# EAGLE design STM32F446RET-Breakout (EAGLE 7.6.0)
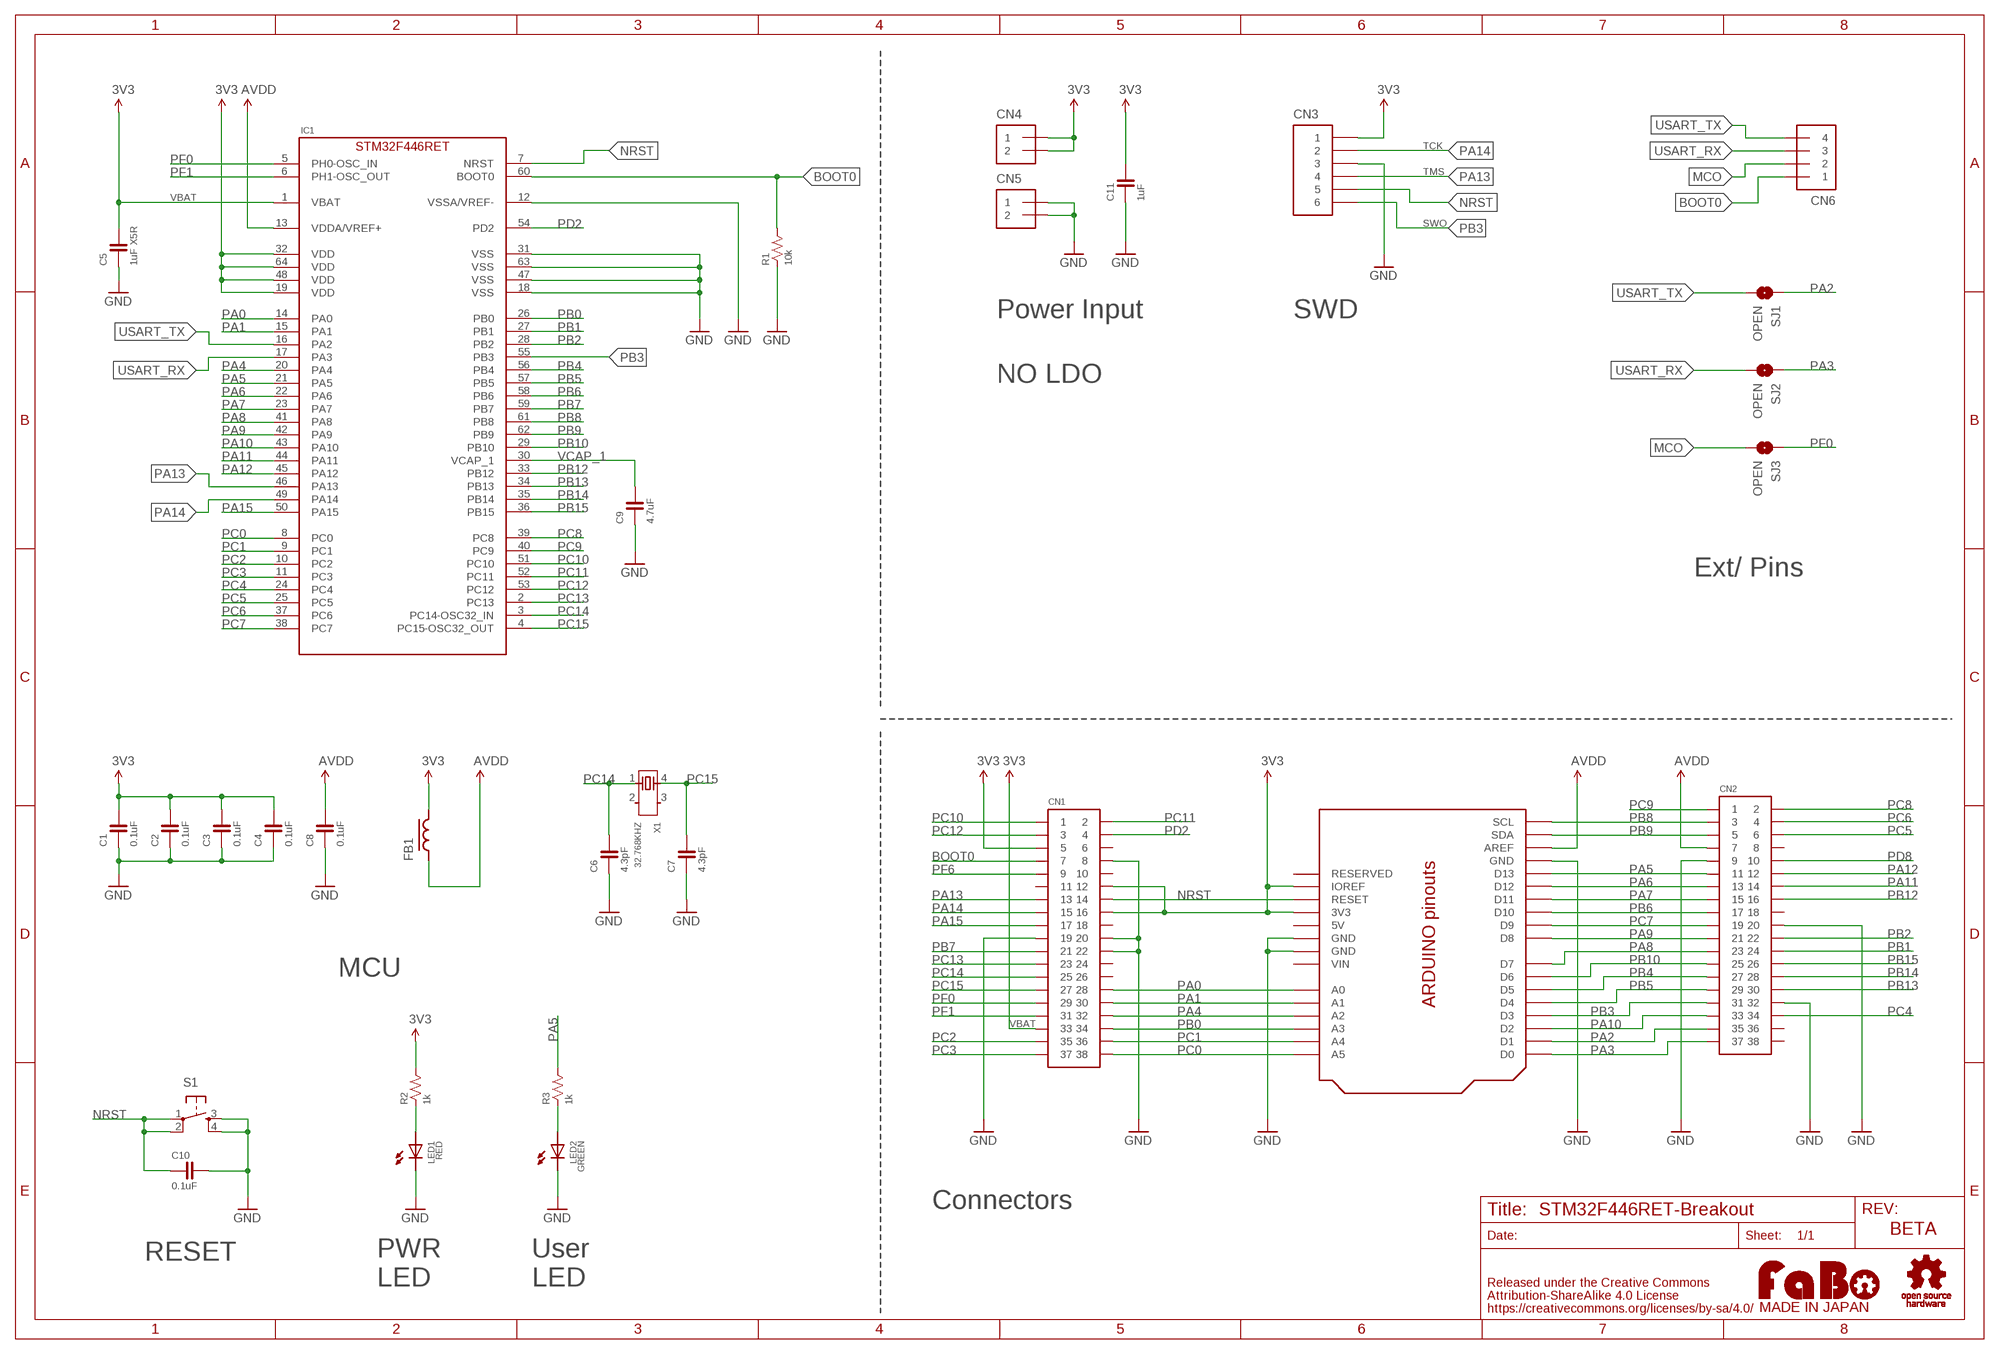
[diagram p0: schematic, sheet 1]

## Parts
C1  0.1uF  CAPACITOR-0603  [0603]
C2  0.1uF  CAPACITOR-0603  [0603]
C3  0.1uF  CAPACITOR-0603  [0603]
C4  0.1uF  CAPACITOR-0603  [0603]
C5  1uF X5R  CAPACITOR-0603  [0603]
C6  4.3pF  CAPACITOR-0603  [0603]
C7  4.3pF  CAPACITOR-0603  [0603]
C8  0.1uF  CAPACITOR-0603  [0603]
C9  4.7uF  CAPACITOR-0603  [0603]
C10  0.1uF  CAPACITOR-0603  [0603]
C11  1uF  CAPACITOR-0603  [0603]
CN1  PIN_HEADER_2X19  [PIN_2X19]
CN2  PIN_HEADER_2X19  [PIN_2X19]
CN3  PIN_HEADER_1X6  [PIN_1X6]
CN4  PIN_HEADER_1X2  [PIN_1X2_LONG]
CN5  PIN_HEADER_1X2  [PIN_1X2_LONG]
CN6  PIN_HEADER_1X4  [PIN_1X4_SNEAKY]
FB1  FERRITEBEADS  [EIA0603]
IC1  STM32F446RET  [LQFP-64]
LED1  RED  LED-0603  [0603]
LED2  GREEN  LED-0603  [0603]
R1  10k  RESISTOR-0603  [0603]
R2  1k  RESISTOR-0603  [0603]
R3  1k  RESISTOR-0603  [0603]
S1  TACT-SWITCH-6MM  [DTS_6_V]
SJ1  OPEN  SMD-JUMPER-2-OPEN  [SMD-JUMPER-2-OPEN]
SJ2  OPEN  SMD-JUMPER-2-OPEN  [SMD-JUMPER-2-OPEN]
SJ3  OPEN  SMD-JUMPER-2-OPEN  [SMD-JUMPER-2-OPEN]
U1  ARDUINO_UNO_R3_SHIELD-NUCLEO  [NUCLEO]
U$2  LOGO_FABO-M  [LOGO_FABO_MS]
U$3  LOGO_OSHW-M_BOTTOM  [LOGO_OSHW_M_BOTTOM]
X1  32.768KHZ  CRYSTAL-4PIN  [ABRACON-ABS25-32.768KHZ]

## Nets
3V3: C1.2 C2.2 C3.2 C4.2 C5.2 C11.2 CN1.5 CN1.12 CN1.16 CN1.33 CN3.1 CN4.1 CN4.2 FB1.2 IC1.1(VBAT) IC1.19(VDD) IC1.32(VDD) IC1.48(VDD) IC1.64(VDD) R2.2 U1.3V3 U1.IOREF
AVDD: C8.2 CN2.7 FB1.1 IC1.13(VDDA/VREF+) U1.AREF
BOOT0: CN1.7 CN6.1 IC1.60(BOOT0) R1.2
GND: C1.1 C2.1 C3.1 C4.1 C5.1 C6.1 C7.1 C8.1 C9.1 C10.2 C11.1 CN1.8 CN1.19 CN1.20 CN1.22 CN2.9 CN2.20 CN2.32 CN3.3 CN5.1 CN5.2 IC1.12(VSSA/VREF-) IC1.18(VSS) IC1.31(VSS) IC1.47(VSS) IC1.63(VSS) LED1.CATHODE LED2.CATHODE R1.1 S1.3 S1.4 U1.GND1(GND) U1.GND2(GND) U1.GND3(GND)
MCO: CN6.2 SJ3.2
NRST: C10.1 CN1.14 CN3.5 IC1.7(NRST) S1.1 S1.2 U1.RESET
PA0: CN1.28 IC1.14(PA0) U1.A0
PA1: CN1.30 IC1.15(PA1) U1.A1
PA2: CN2.35 SJ1.1 U1.D1
PA3: CN2.37 SJ2.1 U1.D0
PA4: CN1.32 IC1.20(PA4) U1.A2
PA5: CN2.11 IC1.21(PA5) R3.2 U1.D13
PA6: CN2.13 IC1.22(PA6) U1.D12
PA7: CN2.15 IC1.23(PA7) U1.D11
PA8: CN2.23 IC1.41(PA8) U1.D7
PA9: CN2.21 IC1.42(PA9) U1.D8
PA10: CN2.33 IC1.43(PA10) U1.D2
PA11: CN2.14 IC1.44(PA11)
PA12: CN2.12 IC1.45(PA12)
PA13: CN1.13 CN3.4 IC1.46(PA13)
PA14: CN1.15 CN3.2 IC1.49(PA14)
PA15: CN1.17 IC1.50(PA15)
PB0: CN1.34 IC1.26(PB0) U1.A3
PB1: CN2.24 IC1.27(PB1)
PB2: CN2.22 IC1.28(PB2)
PB3: CN2.31 CN3.6 IC1.55(PB3) U1.D3
PB4: CN2.27 IC1.56(PB4) U1.D5
PB5: CN2.29 IC1.57(PB5) U1.D4
PB6: CN2.17 IC1.58(PB6) U1.D10
PB7: CN1.21 IC1.59(PB7)
PB8: CN2.3 IC1.61(PB8) U1.SCL
PB9: CN2.5 IC1.62(PB9) U1.SDA
PB10: CN2.25 IC1.29(PB10) U1.D6
PB12: CN2.16 IC1.33(PB12)
PB13: CN2.30 IC1.34(PB13)
PB14: CN2.28 IC1.35(PB14)
PB15: CN2.26 IC1.36(PB15)
PC0: CN1.38 IC1.8(PC0) U1.A5
PC1: CN1.36 IC1.9(PC1) U1.A4
PC2: CN1.35 IC1.10(PC2)
PC3: CN1.37 IC1.11(PC3)
PC4: CN2.34 IC1.24(PC4)
PC5: CN2.6 IC1.25(PC5)
PC6: CN2.4 IC1.37(PC6)
PC7: CN2.19 IC1.38(PC7) U1.D9
PC8: CN2.2 IC1.39(PC8)
PC9: CN2.1 IC1.40(PC9)
PC10: CN1.1 IC1.51(PC10)
PC11: CN1.2 IC1.52(PC11)
PC12: CN1.3 IC1.53(PC12)
PC13: CN1.23 IC1.2(PC13)
PC14: C6.2 CN1.25 IC1.3(PC14-OSC32_IN) X1.1
PC15: C7.2 CN1.27 IC1.4(PC15-OSC32_OUT) X1.4
PD2: CN1.4 IC1.54(PD2)
PD8: CN2.10
PF0: CN1.29 IC1.5(PH0-OSC_IN) SJ3.1
PF1: CN1.31 IC1.6(PH1-OSC_OUT)
PF6: CN1.9
PWRLEDA: LED1.ANODE R2.1
USART_RX: CN6.3 IC1.17(PA3) SJ2.2
USART_TX: CN6.4 IC1.16(PA2) SJ1.2
USRLEDA: LED2.ANODE R3.1
VCAP_1: C9.2 IC1.30(VCAP_1)
Unconnected: CN1.6 CN1.10 CN1.11 CN1.18 CN1.24 CN1.26 CN2.8 CN2.18 CN2.36 CN2.38 U1.RESERVED X1.2 X1.3

## Notes on the sheet
- TCK
- TMS
- VBAT
- SWO
- Power Input | SWD
- NO LDO
- Ext/ Pins
- MCU
- VBAT
- Connectors
- BETA
- RESET
- PWR
  LED
- User
  LED

## Power pins joined to a net without a drawn wire
5V: U1.5V
VIN: U1.VIN

## Library data of the parts
C1-C11 = FaBo-Capacitor:CAPACITOR: CAPACITOR
CN1 CN2 = FaBo-PIN:PIN_HEADER_2X19
CN3 = FaBo-PIN:PIN_HEADER_1X6
CN4 CN5 = FaBo-PIN:PIN_HEADER_1X2
CN6 = FaBo-PIN:PIN_HEADER_1X4
FB1 = FaBo-etc:FERRITEBEADS
IC1 = FaBo-MPU:STM32F446RET
LED1 LED2 = FaBo-LED:LED
R1-R3 = FaBo-Resistors:RESISTOR: RESISTOR
S1 = FaBo-Switch:TACT-SWITCH
SJ1-SJ3 = FaBo-Supply:SMD-JUMPER-2
U1 = FaBo-Boards:ARDUINO_UNO_R3_SHIELD
U$2 = FaBo-etc:LOGO_FABO
U$3 = FaBo-etc:LOGO_OSHW
X1 = FaBo-Crystal:CRYSTAL-4PIN

## Board
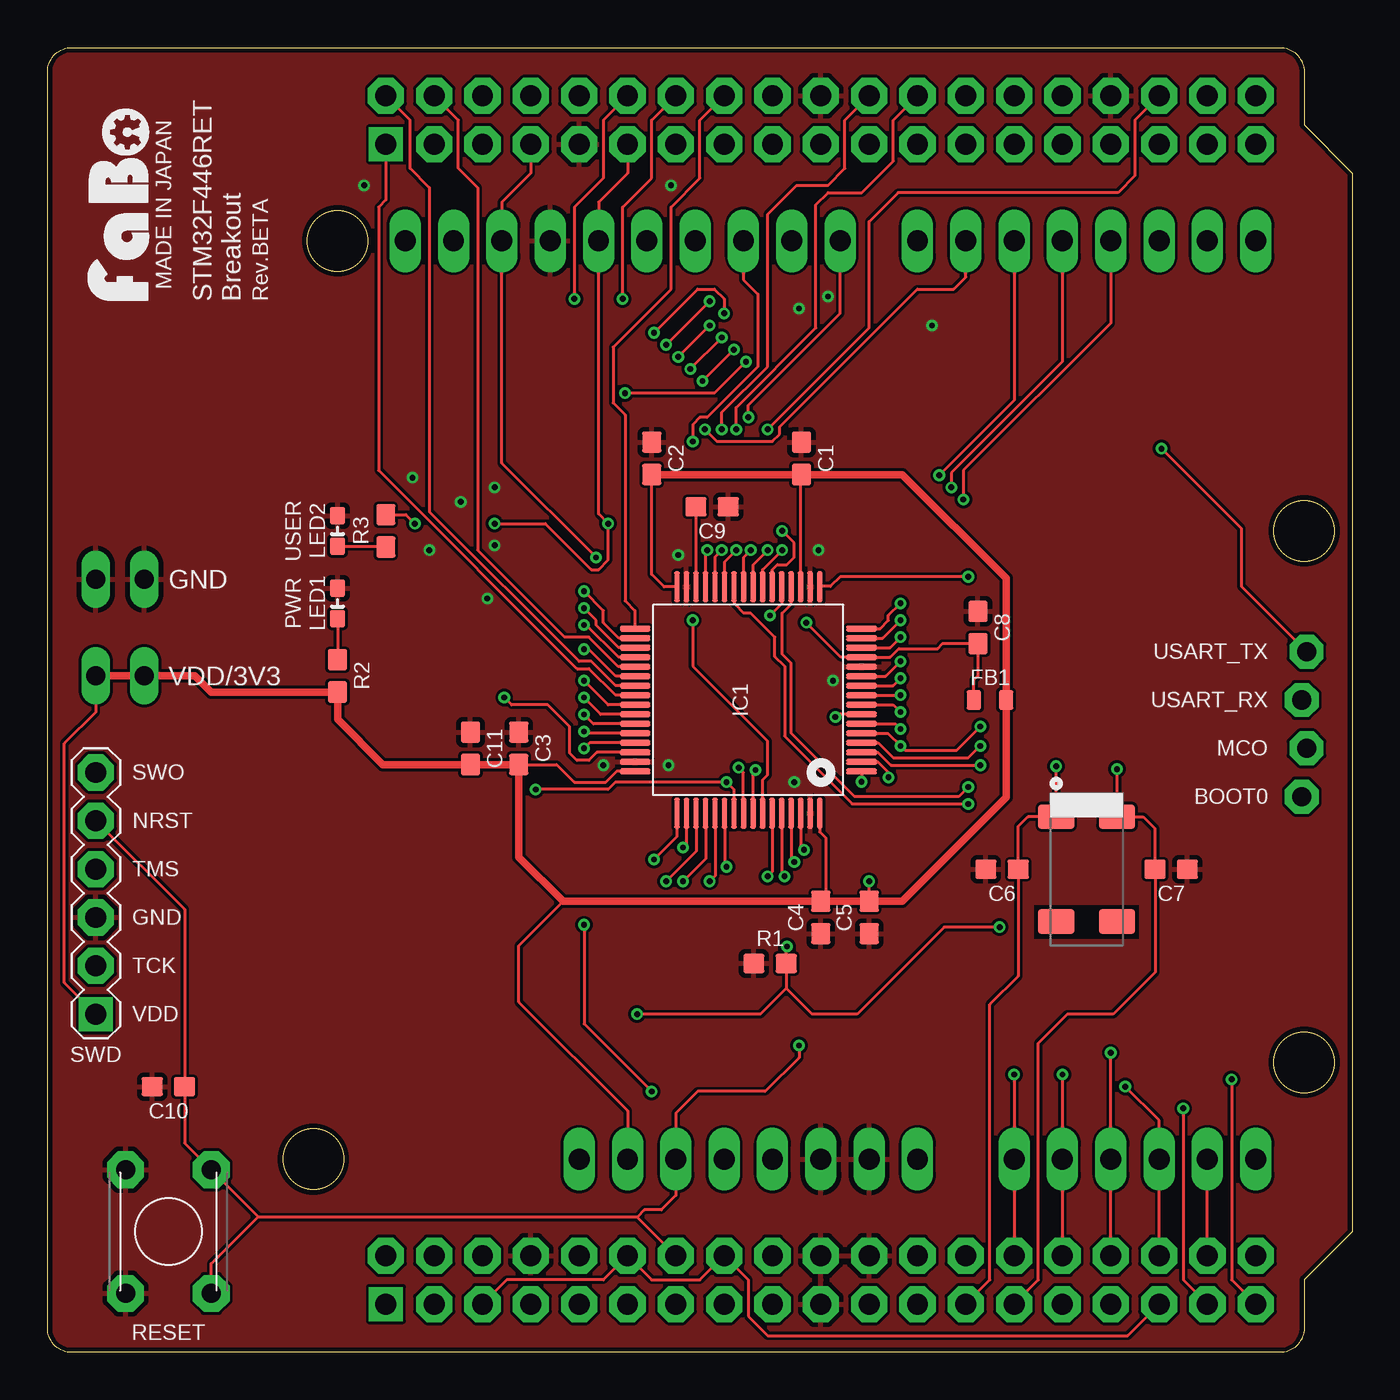
[diagram p1: board, top side]
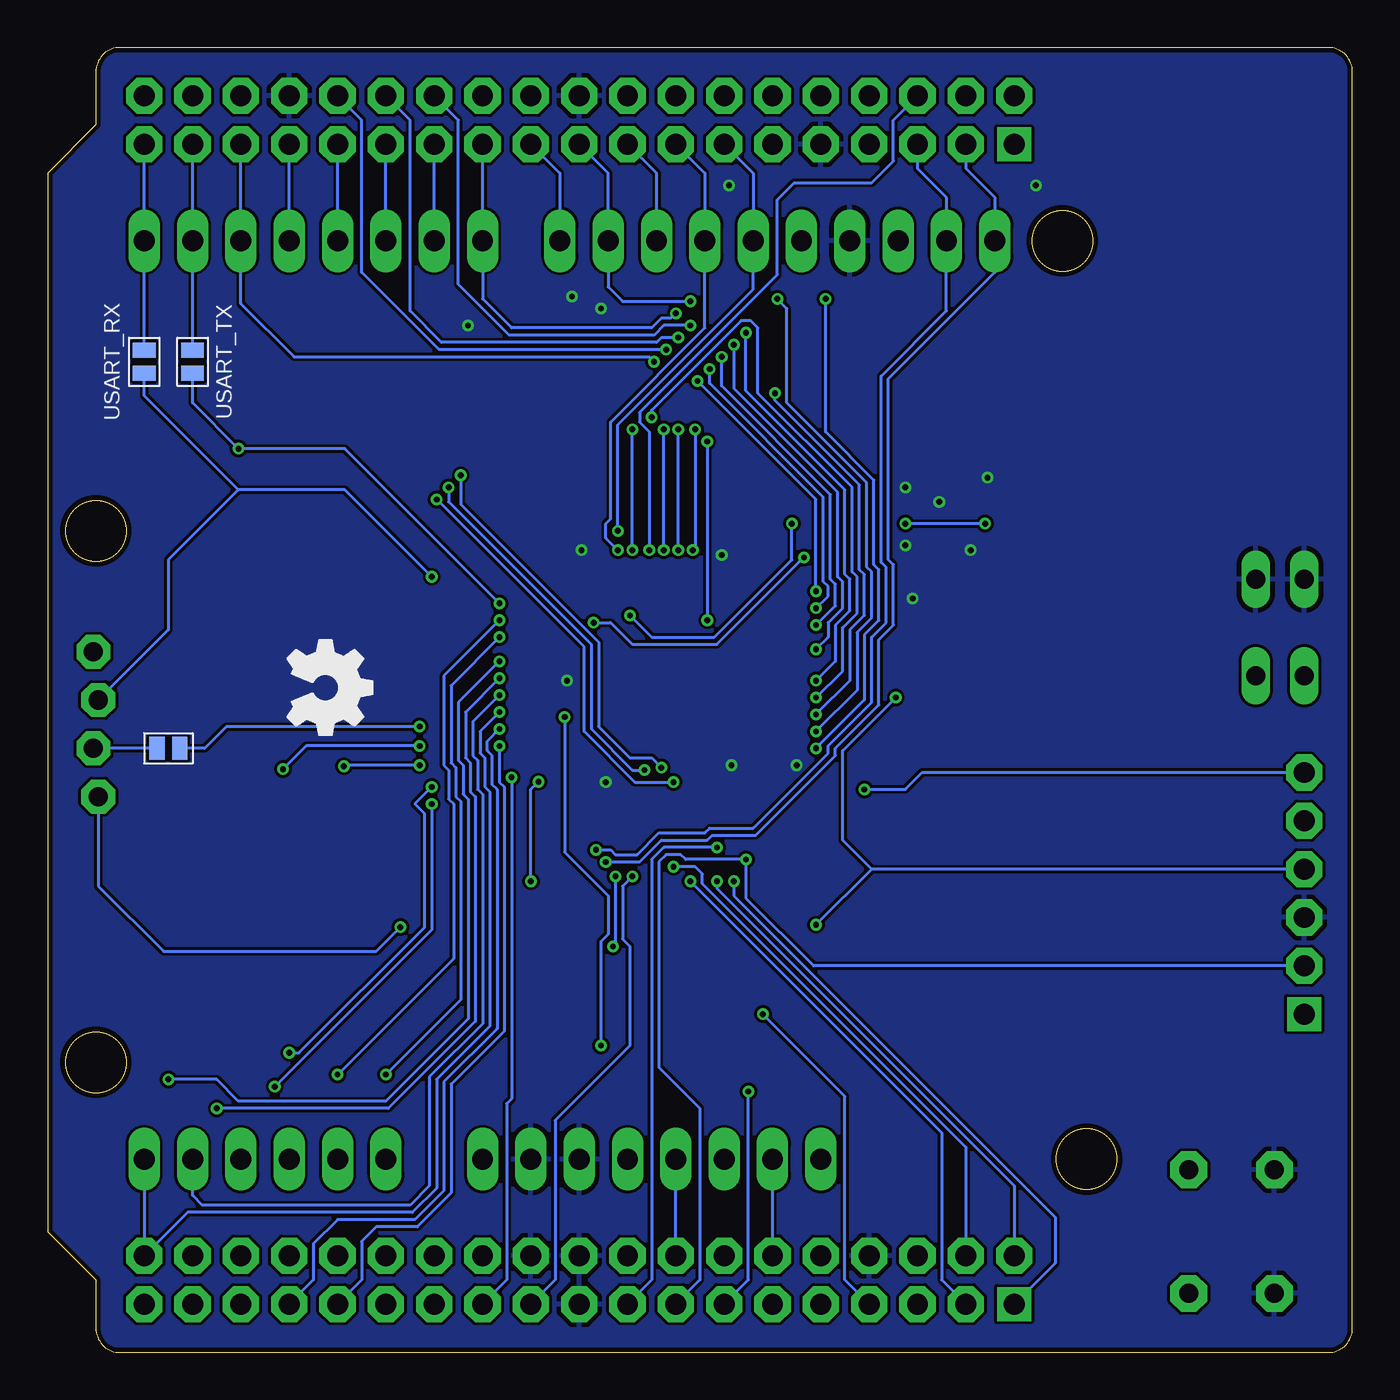
[diagram p2: board, bottom side, seen from below]

Size 68.58 x 68.58 mm. Coordinates in mm from the lower left corner, seen from the top.
Copper layers (1*16): Top 0.035mm / dielectric 1.5mm / Bottom 0.035mm
Design rules "Elecrow_angle": minimum track width 6mil, minimum drill 12mil, track to track 6mil, track to pad 6mil, pad to pad 6mil, via to via 6mil, smd to smd 0mil, copper to edge 10mil, drill to drill 10mil, minimum pad ring 10mil, minimum via ring 6mil, stop-mask expansion 2mil, vias tented up to drill 100mil, thermal gap 10mil

### Footprints (pad centres in the part's own frame; a part is rotated, then mirrored left to right if it is on the bottom)
0603 = smd 1.1 x 1: 1 -0.85,0; 2 0.85,0
PIN_2X19 = drill 1.1 pad 1.778 square: 1 -1.27,22.86 | drill 1.1 pad 1.9 octagon: 2 1.27,22.86; 3 -1.27,20.32; 4 1.27,20.32; 5 -1.27,17.78; 6 1.27,17.78; 7 -1.27,15.24; 8 1.27,15.24; 9 -1.27,12.7; 10 1.27,12.7; 11 -1.27,10.16; 12 1.27,10.16; 13 -1.27,7.62; 14 1.27,7.62; 15 -1.27,5.08; 16 1.27,5.08; 17 -1.27,2.54; 18 1.27,2.54; 19 -1.27,0; 20 1.27,0; 21 -1.27,-2.54; 22 1.27,-2.54; 23 -1.27,-5.08; 24 1.27,-5.08; 25 -1.27,-7.62; 26 1.27,-7.62; 27 -1.27,-10.16; 28 1.27,-10.16; 29 -1.27,-12.7; 30 1.27,-12.7; 31 -1.27,-15.24; 32 1.27,-15.24; 33 -1.27,-17.78; 34 1.27,-17.78; 35 -1.27,-20.32; 36 1.27,-20.32; 37 -1.27,-22.86; 38 1.27,-22.86
PIN_1X6 = drill 1.1 pad 1.778 square: 1 -6.35,0 | drill 1.1 pad 1.9 octagon: 2 -3.81,0; 3 -1.27,0; 4 1.27,0; 5 3.81,0; 6 6.35,0
PIN_1X2_LONG = drill 1 long: 1 -1.27,0; 2 1.27,0
PIN_1X4_SNEAKY = drill 1 pad 1.778 octagon: 1 -3.81,0.127; 2 -1.27,-0.127; 3 1.27,0.127; 4 3.81,-0.127
EIA0603 = smd 0.75 x 1: 1 -0.85,0; 2 0.85,0
LQFP-64 = smd 0.3 x 1.6: 1 -3.75,-5.95; 2 -3.25,-5.95; 3 -2.75,-5.95; 4 -2.25,-5.95; 5 -1.75,-5.95; 6 -1.25,-5.95; 7 -0.75,-5.95; 8 -0.25,-5.95; 9 0.25,-5.95; 10 0.75,-5.95; 11 1.25,-5.95; 12 1.75,-5.95; 13 2.25,-5.95; 14 2.75,-5.95; 15 3.25,-5.95; 16 3.75,-5.95; 33 3.75,5.95; 34 3.25,5.95; 35 2.75,5.95; 36 2.25,5.95; 37 1.75,5.95; 38 1.25,5.95; 39 0.75,5.95; 40 0.25,5.95; 41 -0.25,5.95; 42 -0.75,5.95; 43 -1.25,5.95; 44 -1.75,5.95; 45 -2.25,5.95; 46 -2.75,5.95; 47 -3.25,5.95; 48 -3.75,5.95 | smd 1.6 x 0.3: 17 5.95,-3.75; 18 5.95,-3.25; 19 5.95,-2.75; 20 5.95,-2.25; 21 5.95,-1.75; 22 5.95,-1.25; 23 5.95,-0.75; 24 5.95,-0.25; 25 5.95,0.25; 26 5.95,0.75; 27 5.95,1.25; 28 5.95,1.75; 29 5.95,2.25; 30 5.95,2.75; 31 5.95,3.25; 32 5.95,3.75; 49 -5.95,3.75; 50 -5.95,3.25; 51 -5.95,2.75; 52 -5.95,2.25; 53 -5.95,1.75; 54 -5.95,1.25; 55 -5.95,0.75; 56 -5.95,0.25; 57 -5.95,-0.25; 58 -5.95,-0.75; 59 -5.95,-1.25; 60 -5.95,-1.75; 61 -5.95,-2.25; 62 -5.95,-2.75; 63 -5.95,-3.25; 64 -5.95,-3.75
0603' = smd 0.9 x 0.8: ANODE -0.8,0; CATHODE 0.8,0
DTS_6_V = drill 1 pad 1.93 octagon: 1 -3.25,2.25; 2 3.25,2.25; 3 -3.25,-2.25; 4 3.25,-2.25
SMD-JUMPER-2-OPEN = smd 0.8 x 1.2: 1 -0.6,0; 2 0.6,0
NUCLEO = drill 1.1 long: 3V3 35.56,10.16; 5V 38.1,10.16; A0 50.8,10.16; A1 53.34,10.16; A2 55.88,10.16; A3 58.42,10.16; A4 60.96,10.16; A5 63.5,10.16; AREF 23.876,58.42; D0 63.5,58.42; D1 60.96,58.42; D2 58.42,58.42; D3 55.88,58.42; D4 53.34,58.42; D5 50.8,58.42; D6 48.26,58.42; D7 45.72,58.42; D8 41.656,58.42; D9 39.116,58.42; D10 36.576,58.42; D11 34.036,58.42; D12 31.496,58.42; D13 28.956,58.42; GND1 43.18,10.16; GND2 40.64,10.16; GND3 26.416,58.42; IOREF 30.48,10.16; RESERVED 27.94,10.16; RESET 33.02,10.16; SCL 18.796,58.42; SDA 21.336,58.42; VIN 45.72,10.16
ABRACON-ABS25-32.768KHZ = smd 1.3 x 1.9: 1 -2.75,-1.6; 2 2.75,-1.6; 3 2.75,1.6; 4 -2.75,1.6

### Placement (x,y rotation side)
C1  39.62,46.99 270 top
C2  31.75,46.99 270 top
C3  24.77,31.75 270 top
C4  40.64,22.86 90 top
C5  43.18,22.86 90 top
C6  50.16,25.4 0 top
C7  59.05,25.4 180 top
C8  48.9,38.1 270 top
C9  34.92,44.45 180 top
C10  6.35,13.97 180 top
C11  22.23,31.75 270 top
CN1  40.64,3.81 90 top
CN2  40.64,64.77 90 top
CN3  2.54,24.13 90 top
CN4  3.81,35.56 0 top
CN5  3.81,40.64 0 top
CN6  66.04,33.02 90 top
FB1  49.53,34.29 0 top
IC1  36.83,34.29 90 top
LED1  RED  [0603']  15.24,39.37 90 top
LED2  GREEN  [0603']  15.24,43.18 90 top
R1  37.97,20.45 0 top
R2  15.24,35.56 270 top
R3  17.78,43.18 90 top
S1  6.35,6.35 270 top
SJ1  60.96,52.07 270 bottom
SJ2  63.5,52.07 270 bottom
SJ3  62.23,31.75 180 bottom
U1  0,0 0 top
U$2  5.71,60.33 90 top
U$3  53.98,34.92 90 top
X1  54.61,25.4 270 top

### Tracks (layer width: path | path; a pad name or v marks a point on that pad's centre or on a via)
3V3  (via drill 0.3)
  Top 0.152: IC1.1 v42.78,29.99 | IC1.64 40.58,27.36 40.89,27.05 40.89,23.96 C4.2 | CN1.33 56.77,0.89 37.85,0.89 36.83,1.91 36.83,3.81 CN1.16 34.29,3.81 31.75,3.81 CN1.12 29.21,3.81 24.13,3.81 CN1.5 | C3.2 26.76,30.9 27.69,29.97 29.34,29.97 29.91,30.54 IC1.48 | U1.IOREF 30.48,12.7 24.77,18.41 24.77,21.39 27.09,23.71 | CN3.1 0.89,19.43 0.89,32 2.54,33.66 CN4.1 | C2.2 31.75,40.89 32.4,40.24 IC1.32 | IC1.19 39.58,46.1 C1.2 | C5.2 v43.18,24.77
  Top 0.406: C2.2 C1.2 44.92,46.14 50.38,40.68 FB1.2 50.38,29.17 44.92,23.71 C5.2 C4.2 27.09,23.71 24.77,26.04 C3.2 C11.2 17.61,30.9 15.24,33.27 R2.2 8.6,34.71 7.75,35.56 CN4.2 CN4.1
  Bottom 0.152: v43.18,24.77 43.18,29.59 v42.78,29.99 | CN1.16 U1.3V3 | U1.IOREF CN1.12
AVDD  (via drill 0.3)
  Top 0.152: FB1.1 48.68,35.34 48.9,35.56 C8.2 47.03,37.25 46.77,37 44.74,37 44.29,36.54 IC1.13 41.69,36.54 v39.88,38.35 | v28.83,41.78 23.88,46.74 U1.AREF 23.88,60.45 25.4,61.98 CN2.7
  Bottom 0.152: v28.83,41.78 33.4,37.21 37.85,37.21 38.99,38.35 v39.88,38.35
BOOT0  (via drill 0.3)
  Top 0.152: v38.86,21.34 38.82,21.3 R1.2 38.82,19.14 | 38.82,19.14 37.47,17.78 v30.99,17.78 | IC1.60 38.58,25.17 v38.73,25.02 | 38.82,19.14 40.18,17.78 42.55,17.78 47.12,22.35 v50.04,22.35
  Bottom 0.152: CN1.7 26.67,3.81 26.67,13.46 v30.99,17.78 | v38.73,25.02 38.73,21.46 v38.86,21.34 | CN6.1 65.91,24.51 62.48,21.08 51.31,21.08 v50.04,22.35
GND  (via drill 0.3)
  other vias: 29.21,30.86 41.27,35.31 40.51,42.16 33.15,41.91 32.64,30.86 39.24,29.97 23.5,45.47 21.72,44.7 19.18,45.97 23.5,42.42 20.07,42.16 23.11,39.62 39.5,54.86 41.02,55.5 46.48,53.98 32.77,61.34 16.64,61.34
  pour Bottom: 0,0 68.58,0 68.58,68.58 0,68.58
  pour Top: 0,0 68.58,0 68.58,68.58 0,68.58
MCO
  Bottom 0.152: SJ3.2 CN6.2
NRST  (via drill 0.3)
  Top 0.152: IC1.7 41.54,33.54 v41.4,33.4 | v39.5,16.13 39.5,15.49 37.72,13.72 34.16,13.72 33.02,12.57 U1.RESET 33.02,8.26 32.26,7.49 31.37,7.49 30.99,7.11 | CN1.14 30.99,7.11 | 30.99,7.11 11.09,7.11 | 11.09,7.11 S1.1 7.2,11 C10.1 7.2,23.28 CN3.5 | 11.09,7.11 11.05,7.11 8.6,4.66 S1.2
  Bottom 0.152: v41.4,33.4 41.4,26.29 39.12,24 39.12,21.97 39.5,21.59 v39.5,16.13
PA0  (via drill 0.3)
  Top 0.152: IC1.14 44.28,37.04 v44.83,37.59 | v50.8,14.61 U1.A0 CN1.28
  Bottom 0.152: v44.83,37.59 47.37,35.05 47.37,30.99 47.12,30.73 47.12,29.21 46.86,28.96 46.86,18.54 v50.8,14.61
PA1  (via drill 0.3)
  Top 0.152: IC1.15 43.89,37.54 v44.83,38.48 | v53.34,14.61 U1.A1 CN1.30
  Bottom 0.152: v44.83,38.48 47.75,35.56 47.75,30.86 47.5,30.61 47.5,29.08 47.24,28.83 47.24,20.7 v53.34,14.61
PA2
  Bottom 0.152: SJ1.1 U1.D1 CN2.35
PA3
  Bottom 0.152: SJ2.1 U1.D0 CN2.37
PA4  (via drill 0.3)
  Top 0.152: v48.39,29.72 47.88,29.21 42.42,29.21 39.08,32.55 39.08,36.23 38.61,36.7 38.61,38.86 39.08,39.33 IC1.20 | v55.88,15.75 U1.A2 CN1.32
  Bottom 0.152: v48.39,29.72 49.28,28.83 48.77,28.32 48.77,22.35 55.37,15.75 v55.88,15.75
PA5  (via drill 0.3)
  Top 0.152: IC1.21 38.58,39.34 v37.97,38.73 | CN2.11 30.48,61.98 28.96,60.45 U1.D13 28.96,44.07 v29.46,43.56 29.46,41.66 28.96,41.15 28.57,41.15 26.16,43.56 v23.5,43.56 | R3.2 18.84,44.03 v19.3,43.56
  Bottom 0.152: v37.97,38.73 36.83,37.59 33.53,37.59 29.46,41.66 v29.46,43.56 | v19.3,43.56 v23.5,43.56
PA6  (via drill 0.3)
  Top 0.152: IC1.22 38.08,41.13 38.35,41.4 38.86,41.4 39.24,41.78 39.24,42.55 v38.61,43.18
  Bottom 0.152: v38.61,43.18 38.61,48.77 31.5,55.88 U1.D12 31.5,61.98 CN2.13
PA7  (via drill 0.3)
  Top 0.152: IC1.23 37.58,41.14 v38.61,42.16
  Bottom 0.152: v38.61,42.16 39.24,42.8 39.24,43.56 38.99,43.81 38.99,48.9 34.04,53.85 U1.D11 34.04,61.98 CN2.15
PA8  (via drill 0.3)
  Top 0.152: IC1.41 29.46,34.04 v28.19,35.31 | v31.88,53.59 34.16,55.88 35.05,55.88 35.56,55.37 v35.56,54.61
  Bottom 0.152: v28.19,35.31 27.18,36.32 27.18,38.23 26.42,38.99 26.42,40.64 26.67,40.89 26.67,45.34 31.88,50.55 v31.88,53.59 | CN2.23 U1.D7 45.72,55.37 44.2,53.85 36.83,53.85 36.32,54.36 35.81,54.36 v35.56,54.61
PA9  (via drill 0.3)
  Top 0.152: IC1.42 29.07,33.54 v28.19,34.42 | U1.D8 41.66,54.61 36.83,49.78 v36.83,49.15
  Bottom 0.152: v28.19,34.42 26.8,35.81 26.8,38.1 26.04,38.86 26.04,40.77 26.29,41.02 26.29,45.47 31.24,50.42 31.24,53.85 31.62,54.23 32.13,54.23 36.83,49.53 v36.83,49.15 | CN2.21 41.66,61.98 U1.D8
PA10  (via drill 0.3)
  Top 0.152: IC1.43 28.68,33.04 v28.19,33.53 | v36.7,52.07 35.05,50.42 v30.35,50.42
  Bottom 0.152: v28.19,33.53 26.42,35.31 26.42,37.97 25.65,38.73 25.65,40.89 25.91,41.15 25.91,45.59 30.35,50.04 v30.35,50.42 | CN2.33 U1.D2 58.42,55.12 55.63,52.32 36.96,52.32 v36.7,52.07
PA11  (via drill 0.3)
  Top 0.152: v30.23,55.37 30.23,60.2 31.75,61.72 31.75,64.77 CN2.14 | IC1.44 28.29,32.54 v28.19,32.64
  Bottom 0.152: v28.19,32.64 26.04,34.8 26.04,37.85 25.27,38.61 25.27,41.02 25.53,41.27 25.53,45.72 29.72,49.91 29.72,54.86 v30.23,55.37
PA12  (via drill 0.3)
  Top 0.152: CN2.12 29.21,64.77 29.21,61.72 27.69,60.2 v27.69,55.37 | IC1.45 28.48,32.04 v28.19,31.75
  Bottom 0.152: v27.69,55.37 27.69,48.39 25.15,45.85 25.15,41.4 24.89,41.15 24.89,38.48 25.65,37.72 25.65,34.29 v28.19,31.75
PA13  (via drill 0.3)
  Top 0.152: v28.19,22.48 28.19,17.27 v31.75,13.72 | IC1.46 28.87,31.54 28.45,31.11 27.81,31.11 27.43,31.5 27.43,32.89 26.29,34.04 24.38,34.04 v24,34.42
  Bottom 0.152: CN1.13 31.75,3.81 v31.75,13.72 | CN3.4 25.27,25.4 | v24,34.42 26.8,31.62 26.8,26.92 25.27,25.4 | 25.27,25.4 v28.19,22.48
PA14  (via drill 0.3)
  Top 0.152: IC1.49 33.08,27.11 v31.88,25.91
  Bottom 0.152: CN1.15 34.29,3.81 34.29,12.83 36.45,14.99 36.45,25.78 36.07,26.16 35.31,26.16 35.05,25.91 v31.88,25.91 31.88,23.88 28.32,20.32 CN3.2
PA15  (via drill 0.3)
  Top 0.152: IC1.50 33.58,26.72 v33.4,26.54
  Bottom 0.152: v33.4,26.54 36.2,26.54 36.83,25.91 36.83,3.81 CN1.17
PB0  (via drill 0.3)
  Top 0.152: IC1.26 36.08,39.36 36.1,39.36 36.6,38.86 36.96,38.86 38.23,37.59 38.23,36.58 38.73,36.07 38.73,32.38 42.29,28.83 v48.39,28.83 | v56.64,13.97 58.42,12.19 U1.A3 CN1.34
  Bottom 0.152: v48.39,28.83 48.39,22.23 v56.64,13.97
PB1  (via drill 0.3)
  Top 0.152: IC1.27 35.58,41.55 v36.2,42.16 | v36.2,48.51 36.2,49.66 40.39,53.85 40.39,60.33 41.02,60.96 42.8,60.96 44.45,62.61 44.45,64.77 CN2.24
  Bottom 0.152: v36.2,42.16 v36.2,48.51
PB2  (via drill 0.3)
  Top 0.152: v35.43,48.51 35.43,49.4 37.85,51.82 37.85,59.82 39.37,61.34 41.02,61.34 41.91,62.23 41.91,64.77 CN2.22 | IC1.28 35.08,41.81 v35.43,42.16
  Bottom 0.152: v35.43,42.16 v35.43,48.51
PB3  (via drill 0.3)
  Top 0.152: U1.D3 55.88,54.1 48.13,46.35 v48.13,44.83 | IC1.55 36.08,29.58 v35.69,29.97 29.84,29.97 29.46,29.59 v25.65,29.59
  Bottom 0.152: v48.13,44.83 40.39,37.08 40.39,32.64 37.72,29.97 v35.69,29.97 | U1.D3 CN2.31 | v25.65,29.59 23.5,29.59 22.61,30.48 CN3.6
PB4  (via drill 0.3)
  Top 0.152: U1.D5 50.8,50.04 v46.86,46.1 | IC1.56 36.58,30.48 v36.32,30.73
  Bottom 0.152: v46.86,46.1 46.86,44.58 39.62,37.34 39.62,32.89 37.97,31.24 36.83,31.24 v36.32,30.73 | U1.D5 CN2.27
PB5  (via drill 0.3)
  Top 0.152: U1.D4 53.34,52.07 47.5,46.23 v47.5,45.47 | IC1.57 37.08,30.48 v37.21,30.61
  Bottom 0.152: v47.5,45.47 47.5,44.7 40.01,37.21 40.01,32.77 37.85,30.61 v37.21,30.61 | U1.D4 CN2.29
PB6  (via drill 0.3)
  Top 0.152: U1.D10 36.58,56.39 37.34,55.63 37.34,51.82 34.67,49.15 34.29,49.15 33.91,48.77 v33.91,47.88 | IC1.58 37.58,30.09 37.85,30.35 37.85,32.13 33.91,36.07 v33.91,38.48
  Bottom 0.152: U1.D10 36.58,61.98 CN2.17 | v33.91,47.88 v33.91,38.48
PB7  (via drill 0.3)
  Top 0.152: IC1.59 38.08,25.25 v37.85,25.02
  Bottom 0.152: v37.85,25.02 38.35,24.51 38.35,21.72 37.97,21.34 37.97,16.13 41.91,12.19 41.91,3.81 CN1.21
PB8  (via drill 0.3)
  Top 0.152: IC1.61 39.08,25.94 v39.24,25.78
  Bottom 0.152: v39.24,25.78 37.47,25.78 36.32,26.92 33.91,26.92 33.66,27.18 31.37,27.18 27.18,31.37 27.18,31.75 24.89,34.04 24.89,37.47 24.13,38.23 24.13,41.4 24.38,41.66 24.38,51.18 18.8,56.77 U1.SCL 18.8,60.71 20.32,62.23 CN2.3
PB9  (via drill 0.3)
  Top 0.152: IC1.62 39.58,26.59 v39.75,26.42
  Bottom 0.152: v39.75,26.42 38.99,26.42 38.73,26.16 37.59,26.16 36.45,27.3 34.04,27.3 33.78,27.56 31.5,27.56 27.56,31.5 27.56,31.88 25.27,34.16 25.27,37.59 24.51,38.35 24.51,41.27 24.77,41.53 24.77,51.31 21.34,54.74 U1.SDA 21.34,60.71 22.86,62.23 CN2.5
PB10  (via drill 0.3)
  Top 0.152: v34.54,48.51 35.18,47.88 38.1,47.88 38.48,48.26 38.48,48.64 45.72,55.88 47.62,55.88 48.26,56.52 U1.D6 | IC1.29 34.58,42.07 v34.67,42.16
  Bottom 0.152: v34.54,48.51 34.54,42.29 v34.67,42.16 | U1.D6 CN2.25
PB12
  Top 0.152: CN2.16 34.29,64.77 34.29,61.72 32.77,60.2 32.77,55.88 29.72,52.83 29.72,49.91 30.35,49.28 30.35,39.5 30.86,38.99 30.86,38.06 IC1.33
PB13  (via drill 0.3)
  Top 0.152: IC1.34 30.02,37.54 29.21,38.35 29.21,38.99 v28.19,40.01 | v34.42,51.05 v36.07,52.7
  Bottom 0.152: v28.19,40.01 28.19,44.83 v34.42,51.05 | CN2.30 52.07,64.77 52.07,56.77 48.01,52.7 v36.07,52.7
PB14  (via drill 0.3)
  Top 0.152: IC1.35 30.02,37.04 28.83,38.23 28.83,38.48 v28.19,39.12 | v33.78,51.69 v35.43,53.34
  Bottom 0.152: v28.19,39.12 27.56,39.75 27.56,40.26 27.81,40.51 27.81,44.96 33.78,50.93 v33.78,51.69 | v35.43,53.34 36.32,53.34 36.58,53.09 47.88,53.09 49.53,54.74 49.53,64.77 CN2.28
PB15  (via drill 0.3)
  Top 0.152: IC1.36 30.01,36.54 28.32,38.23 v28.19,38.23 | v33.15,52.32 v34.8,53.98
  Bottom 0.152: v28.19,38.23 27.18,39.24 27.18,40.39 27.43,40.64 27.43,45.09 33.15,50.8 v33.15,52.32 | v34.8,53.98 36.2,53.98 36.7,53.47 44.32,53.47 46.99,56.13 46.99,64.77 CN2.26
PC0  (via drill 0.3)
  Top 0.152: IC1.8 44.45,34.04 v44.83,33.66
  Bottom 0.152: v44.83,33.66 45.85,32.64 45.85,31.5 45.59,31.24 45.59,29.72 45.34,29.46 45.34,17.14 48.13,14.35 48.13,8.64 49.4,7.37 61.21,7.37 CN1.38 U1.A5
PC1  (via drill 0.3)
  Top 0.152: IC1.9 v44.83,34.54 | CN1.36 U1.A4
  Bottom 0.152: v44.83,34.54 46.23,33.15 46.23,31.37 45.97,31.11 45.97,29.59 45.72,29.34 45.72,17.27 48.51,14.48 48.51,8.76 49.53,7.75 60.45,7.75 60.96,8.26 U1.A4
PC2  (via drill 0.3)
  Top 0.152: v59.69,12.83 59.69,3.81 CN1.35 | IC1.10 44.44,35.04 v44.83,35.43
  Bottom 0.152: v44.83,35.43 46.61,33.66 46.61,31.24 46.35,30.99 46.35,29.46 46.1,29.21 46.1,17.4 50.67,12.83 v59.69,12.83
PC3  (via drill 0.3)
  Top 0.152: IC1.11 44.05,35.54 v44.83,36.32 | v62.23,14.35 62.23,3.81 CN1.37
  Bottom 0.152: v44.83,36.32 46.99,34.16 46.99,31.11 46.74,30.86 46.74,29.34 46.48,29.08 46.48,17.53 50.8,13.21 58.55,13.21 59.69,14.35 v62.23,14.35
PC4  (via drill 0.3)
  Top 0.152: v37.85,48.51 43.18,53.85 43.18,59.44 44.7,60.96 56.26,60.96 57.15,61.85 57.15,64.77 CN2.34 | IC1.24 37.08,41.4 v37.85,42.16
  Bottom 0.152: v37.85,42.16 v37.85,48.51
PC5  (via drill 0.3)
  Top 0.152: IC1.25 36.58,41.79 v36.96,42.16
  Bottom 0.152: CN2.6 24.13,64.77 24.13,62.61 25.27,61.47 29.34,61.47 30.23,60.58 30.23,56.64 37.47,49.4 37.47,48.9 36.96,48.39 v36.96,42.16
PC6
  Top 0.152: IC1.37 30,36.04 28.45,37.59 27.18,37.59 22.61,42.16 22.61,61.21 21.59,62.23 21.59,64.77 CN2.4
PC7  (via drill 0.3)
  Top 0.152: IC1.38 29.86,35.54 28.45,36.96 v28.19,36.96 | v32.51,52.96 v34.8,55.24
  Bottom 0.152: v28.19,36.96 27.56,37.59 27.56,38.35 26.8,39.12 26.8,40.51 27.05,40.77 27.05,45.21 32.51,50.67 v32.51,52.96 | v34.8,55.24 38.35,55.24 39.12,56.01 U1.D9 39.12,61.98 CN2.19
PC8
  Top 0.152: IC1.39 29.86,35.04 28.57,36.32 27.94,36.32 20.07,44.2 20.07,61.21 19.05,62.23 19.05,64.77 CN2.2
PC9
  Top 0.152: IC1.40 29.85,34.54 28.45,35.94 27.81,35.94 17.4,46.35 17.4,60.2 17.78,60.58 CN2.1
PC10  (via drill 0.3)
  Top 0.152: IC1.51 34.08,26.33 v32.51,24.77
  Bottom 0.152: v32.51,24.77 32.51,24 15.62,7.11 15.62,4.7 CN1.1
PC11  (via drill 0.3)
  Top 0.152: IC1.52 34.58,25.94 v33.4,24.77
  Bottom 0.152: v33.4,24.77 33.4,24.38 17.78,8.76 CN1.2
PC12  (via drill 0.3)
  Top 0.152: IC1.53 35.08,25.05 v34.8,24.77
  Bottom 0.152: v34.8,24.77 21.59,11.56 21.59,3.81 CN1.3
PC13  (via drill 0.3)
  Top 0.152: IC1.2 43.64,31.04 44.2,30.48 v44.2,30.23
  Bottom 0.152: v44.2,30.23 44.2,13.34 44.45,13.08 44.45,3.81 CN1.23
PC14  (via drill 0.3)
  Top 0.152: v53.01,30.81 X1.1 51.52,28.15 51.02,27.65 C6.2 51.02,19.77 49.53,18.29 49.53,3.81 CN1.25 | v49.02,30.86 44.32,30.86 43.64,31.54 IC1.3
  Bottom 0.152: v49.02,30.86 52.96,30.86 v53.01,30.81
PC15  (via drill 0.3)
  Top 0.152: v56.21,30.66 X1.4 57.58,28.15 58.2,27.52 C7.2 58.2,19.98 56.01,17.78 53.59,17.78 52.07,16.26 52.07,3.81 CN1.27 | IC1.4 43.65,32.04 44.45,31.24 48.39,31.24 v49.02,31.88
  Bottom 0.152: v49.02,31.88 54.99,31.88 v56.21,30.66
PD2  (via drill 0.3)
  Top 0.152: IC1.54 35.58,25.63 v35.69,25.53
  Bottom 0.152: CN1.4 20.32,10.79 34.16,24.64 34.16,25.15 34.54,25.53 v35.69,25.53
PF0  (via drill 0.3)
  Top 0.152: IC1.5 44.17,32.54 v44.83,31.88 45.09,31.62 47.75,31.62 v49.02,32.89
  Bottom 0.152: CN1.29 52.07,3.81 52.07,5.84 51.31,6.6 49.15,6.6 47.37,8.38 47.37,14.1 44.58,16.89 44.58,29.72 44.83,29.97 v44.83,31.88 | v49.02,32.89 59.18,32.89 60.33,31.75 SJ3.1
PF1  (via drill 0.3)
  Top 0.152: IC1.6 44.56,33.04 v44.83,32.77
  Bottom 0.152: v44.83,32.77 45.47,32.13 45.47,31.62 45.21,31.37 45.21,29.84 44.96,29.59 44.96,17.02 47.75,14.22 47.75,8.51 49.28,6.99 53.34,6.99 54.61,5.71 54.61,3.81 CN1.31
PWRLEDA
  Top 0.152: LED1.ANODE R2.1
USART_RX  (via drill 0.3)
  Top 0.152: v48.39,40.77 41.66,40.77 41.15,40.26 40.6,40.26 IC1.17
  Bottom 0.152: v48.39,40.77 52.96,45.34 58.55,45.34 | 58.55,45.34 63.5,50.29 SJ2.2 | 58.55,45.34 62.23,41.66 62.23,37.97 CN6.3
USART_TX  (via drill 0.3)
  Top 0.152: IC1.16 43.76,38.04 44.2,38.48 44.2,38.73 v44.83,39.37 | v58.55,47.5 62.74,43.31 62.74,40.26 CN6.4
  Bottom 0.152: v44.83,39.37 52.96,47.5 v58.55,47.5 60.96,49.91 SJ1.2
USRLEDA
  Top 0.152: LED2.ANODE 17.73,42.38 R3.1
VCAP_1
  Top 0.152: IC1.30 C9.2

### Text on the board
tPlace: MADE IN JAPAN | STM32F446RET / Breakout | Rev.BETA | USER | GND | PWR | USART_TX | VDD/3V3 | USART_RX | MCO | SWO | BOOT0 | NRST | TMS | GND | TCK | VDD | SWD | RESET
bPlace: USART_TX | USART_RX